# EAGLE design ccc-interface (EAGLE 7.6.0)
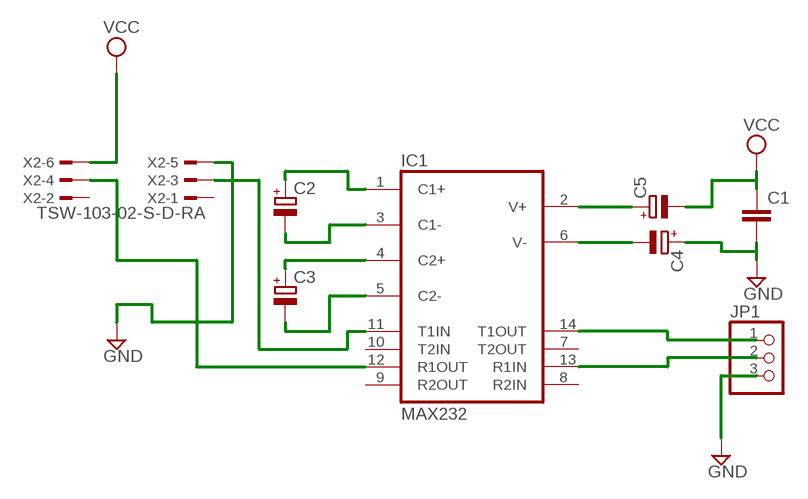
[diagram p0: schematic, sheet 1]

## Parts
C1  C-EU050-024X044  [C050-024X044]
C2  CPOL-EUE1.8-4  [E1,8-4]
C3  CPOL-EUE1.8-4  [E1,8-4]
C4  CPOL-EUE1.8-4  [E1,8-4]
C5  CPOL-EUE1.8-4  [E1,8-4]
IC1  MAX232  [DIL16]
JP1  PINHD-1X3/90  [1X03/90]
X2  TSW-103-02-S-D-RA  [TSW-103-02-S-D-RA]

## Nets
GND: C1.2 C4.+ JP1.3 X2.5
N$1: C2.+ IC1.1(C1+)
N$2: C2.- IC1.3(C1-)
N$3: C5.+ IC1.2(V+)
N$4: C4.- IC1.6(V-)
N$5: C3.+ IC1.4(C2+)
N$6: C3.- IC1.5(C2-)
N$7: IC1.13(R1IN) JP1.2
N$8: IC1.14(T1OUT) JP1.1
N$10: IC1.11(T1IN) X2.3
N$11: IC1.12(R1OUT) X2.4
VCC: C1.1 C5.- X2.6
Unconnected: IC1.7(T2OUT) IC1.8(R2IN) IC1.9(R2OUT) IC1.10(T2IN) X2.1 X2.2

## Power pins joined to a net without a drawn wire
GND: IC1.15(GND)
VCC: IC1.16(VCC)

## Library data of the parts
C1 = rcl:C-EU: CAPACITOR, European symbol
C2-C5 = rcl:CPOL-EU: POLARIZED CAPACITOR, European symbol
IC1 = maxim:MAX232: RS232 TRANSCEIVER; MF: MAXIM; MPN: MAX232ACPE+; OC_FARNELL: 9723773; OC_NEWARK: 68K4544
JP1 = pinhead:PINHD-1X3: PIN HEADER
X2 = con-samtec:TSW-103-02-S-D: THROUGH-HOLE .025" SQ POST HEADER Source: Samtec TSW.pdf; OC_FARNELL: unknown; OC_NEWARK: unknown

## Board
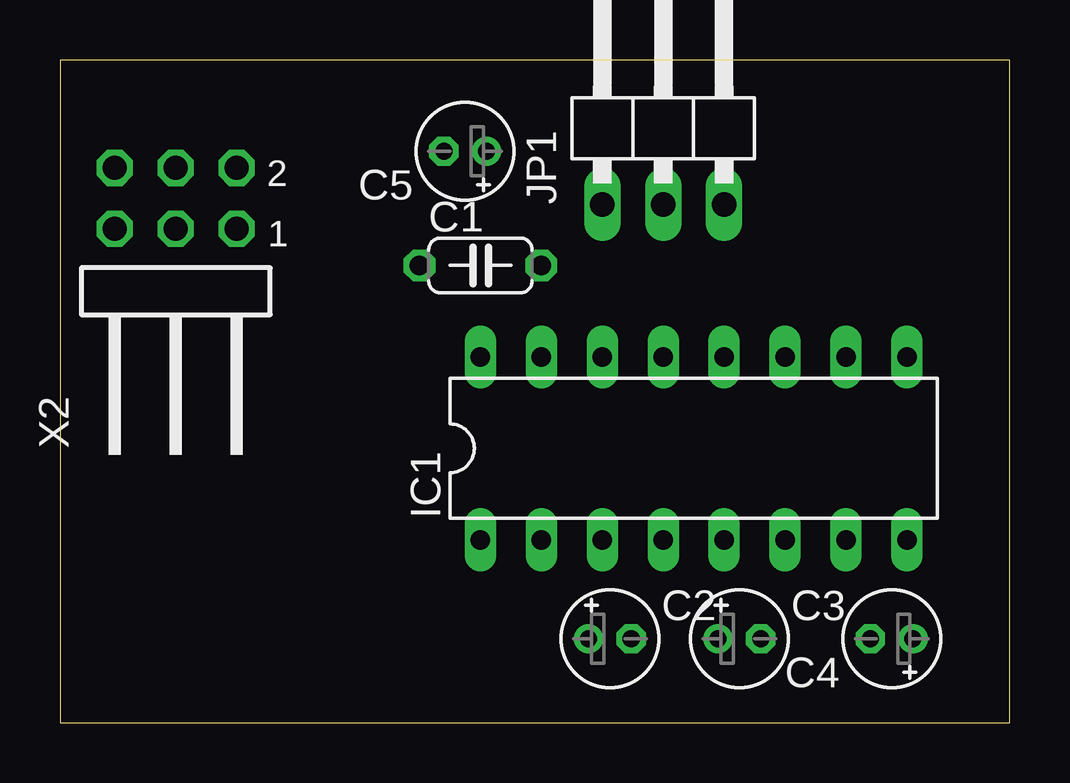
[diagram p1: board, top side]
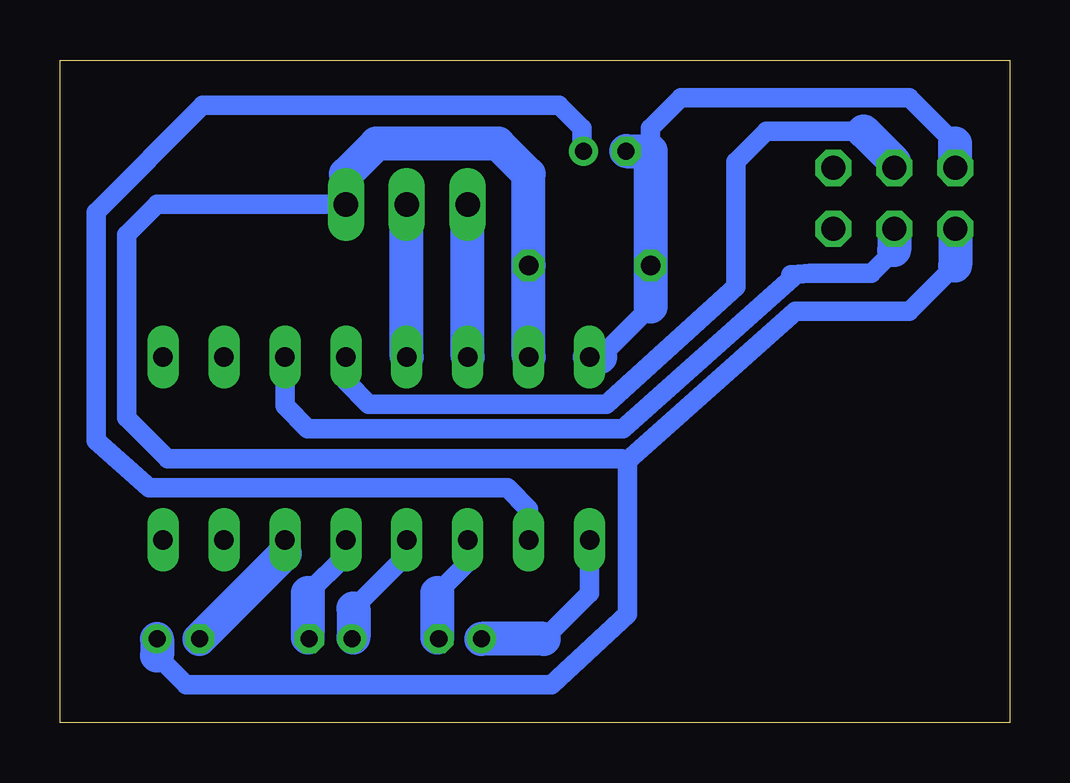
[diagram p2: board, bottom side, seen from below]

Size 39.6 x 27.61 mm. Coordinates in mm from the lower left corner, seen from the top.
Outline: 0,0 39.6,0 39.6,27.61 0,27.61 0,0
Copper layers (1*16): Top 0.035mm / dielectric 1.5mm / Bottom 0.035mm
Design rules "default": minimum track width 10mil, minimum drill 0.6mm, track to track 8mil, track to pad 8mil, pad to pad 8mil, via to via 8mil, smd to smd 8mil, copper to edge 40mil, drill to drill 8mil, minimum pad ring 10mil, minimum via ring 8mil, stop-mask expansion 4mil, vias tented up to drill 0mil, thermal gap 10mil

### Footprints (pad centres in the part's own frame; a part is rotated, then mirrored left to right if it is on the bottom)
C050-024X044 = drill 0.813 octagon: 1 -2.54,0; 2 2.54,0
E1,8-4 = drill 0.711 pad 1.168: + -0.889,0 | drill 0.711 pad 1.168 octagon: - 0.889,0
DIL16 = drill 0.813 long: 1 -8.89,-3.81; 2 -6.35,-3.81; 3 -3.81,-3.81; 4 -1.27,-3.81; 5 1.27,-3.81; 6 3.81,-3.81; 7 6.35,-3.81; 8 8.89,-3.81; 9 8.89,3.81; 10 6.35,3.81; 11 3.81,3.81; 12 1.27,3.81; 13 -1.27,3.81; 14 -3.81,3.81; 15 -6.35,3.81; 16 -8.89,3.81
1X03/90 = drill 1.016 long: 1 -2.54,-3.81; 2 0,-3.81; 3 2.54,-3.81
TSW-103-02-S-D-RA = drill 1 pad 1.5 octagon: 1 2.54,1.524; 2 2.54,4.064; 3 0,1.524; 4 0,4.064; 5 -2.54,1.524; 6 -2.54,4.064

### Placement (x,y rotation side)
C1  17.53,19.05 0 top
C2  22.92,3.49 0 top
C3  28.32,3.49 0 top
C4  34.67,3.49 180 top
C5  16.89,23.81 180 top
IC1  26.42,11.43 0 top
JP1  25.15,25.4 0 top
X2  4.83,19.05 0 top

### Tracks (layer width: path | path; a pad name or v marks a point on that pad's centre or on a via)
GND
  Bottom 0.813: 2.29,19.05 4.19,17.14 8.95,17.14 15.94,10.92 | 15.94,10.92 16.19,10.99 35.12,10.99 36.83,12.7 36.83,20.32 35.56,21.59 JP1.3 | 35.56,2.79 34.35,1.59 19.11,1.59 15.94,4.51 15.94,10.92
  Bottom 1.422: X2.5 2.29,19.05 | IC1.15 C1.2 20.07,22.86 21.34,24.13 26.42,24.13 27.69,22.86 JP1.3 | C4.+ 35.56,2.79
N$1
  Bottom 0.813: IC1.1 17.53,5.4 19.43,3.49
  Bottom 1.422: 19.43,3.49 C2.+
N$2
  Bottom 0.813: IC1.3 22.61,6.67 23.88,5.4 | 23.88,3.56 C2.-
  Bottom 1.422: 23.88,5.4 23.88,3.56
N$3
  Bottom 0.813: IC1.2 20.07,8.89 20.95,9.78 35.88,9.78 38.1,11.75 38.1,21.27 33.66,25.72 18.8,25.72 17.84,24.77 17.84,23.88 C5.+
N$4
  Bottom 0.813: IC1.6 30.23,7.05
  Bottom 1.422: 30.23,7.05 C4.-
N$5
  Bottom 0.813: IC1.4 25.15,6.99 27.37,4.76 | 27.37,3.56 C3.+
  Bottom 1.422: 27.37,4.76 27.37,3.56
N$6
  Bottom 0.813: IC1.5 27.69,6.99 29.27,5.4 | 29.27,3.56 C3.-
  Bottom 1.422: 29.27,5.4 29.27,3.56
N$7
  Bottom 1.422: IC1.13 JP1.2
N$8
  Bottom 1.422: IC1.14 JP1.1
N$10
  Bottom 0.813: 4.83,19.68 5.78,18.73 8.32,18.73 9.14,18.67 9.08,18.54 16.13,12.26 29.27,12.26 30.23,13.21 IC1.11
  Bottom 1.422: X2.3 4.83,19.68
N$11
  Bottom 0.813: 6.1,24.64 10.16,24.64 11.43,23.37 11.43,18.16 16.83,13.27 26.73,13.27 27.69,14.22 IC1.12
  Bottom 1.422: X2.4 4.83,23.37 6.1,24.64
VCC
  Bottom 0.813: 2.29,24.13 4.19,26.04 13.72,26.04 14.99,24.77 14.99,23.81 | 14.99,17.34 17.08,15.24
  Bottom 1.422: X2.6 2.29,24.13 | 14.99,17.34 C1.1 14.99,23.81 C5.- | 17.08,15.24 IC1.16